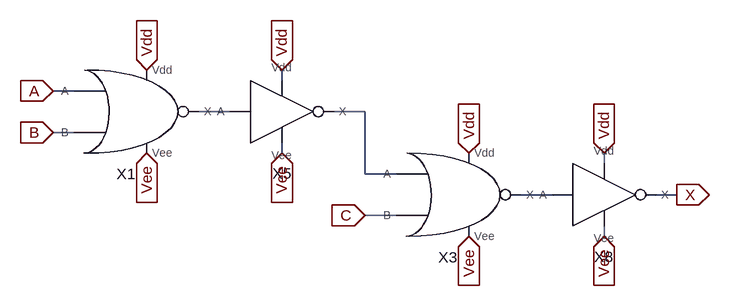
[diagram p0: schematic 3-NOR.asc]
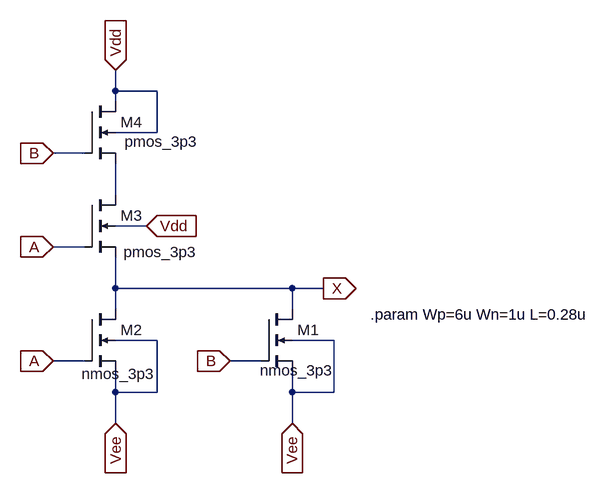
[diagram p1: sub-circuit nor2x1.asc]
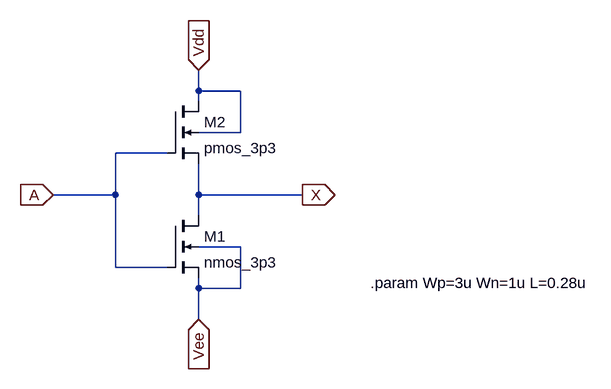
[diagram p2: sub-circuit invx1.asc]
3-NOR.asc, the LTspice schematic file:
Version 4.1
SHEET 1 880 680
WIRE 32 -32 32 -48
WIRE -288 -16 -320 -16
WIRE -48 16 -96 16
WIRE 160 16 112 16
WIRE -288 48 -320 48
WIRE 32 80 32 64
WIRE 528 96 528 80
WIRE 160 112 160 16
WIRE 208 112 160 112
WIRE 448 144 400 144
WIRE 640 144 608 144
WIRE 208 176 160 176
WIRE 528 208 528 192
FLAG -176 80 Vee
IOPIN -176 80 In
FLAG 32 -48 Vdd
IOPIN 32 -48 In
FLAG 32 80 Vee
IOPIN 32 80 In
FLAG 320 208 Vee
IOPIN 320 208 In
FLAG 528 80 Vdd
IOPIN 528 80 In
FLAG 528 208 Vee
IOPIN 528 208 In
FLAG 640 144 X
IOPIN 640 144 Out
FLAG -320 -16 A
IOPIN -320 -16 In
FLAG -320 48 B
IOPIN -320 48 In
FLAG 160 176 C
IOPIN 160 176 In
FLAG -176 -48 Vdd
IOPIN -176 -48 In
FLAG 320 80 Vdd
IOPIN 320 80 In
SYMBOL NOR2x1 -208 16 R0
SYMATTR InstName X1
SYMBOL NOR2x1 288 144 R0
SYMATTR InstName X3
SYMBOL INVx1 32 16 R0
SYMATTR InstName X5
SYMBOL INVx1 528 144 R0
SYMATTR InstName X8

nor2x1.asc, the sub-circuit schematic file:
Version 4.1
SHEET 1 2956 680
WIRE 1680 -496 1680 -528
WIRE 1744 -496 1680 -496
WIRE 1680 -480 1680 -496
WIRE 1744 -432 1744 -496
WIRE 1744 -432 1680 -432
WIRE 1632 -400 1584 -400
WIRE 1680 -336 1680 -384
WIRE 1728 -288 1680 -288
WIRE 1632 -256 1584 -256
WIRE 1680 -192 1680 -240
WIRE 1952 -192 1680 -192
WIRE 2000 -192 1952 -192
WIRE 1680 -160 1680 -192
WIRE 1952 -160 1952 -192
WIRE 1744 -112 1680 -112
WIRE 2016 -112 1952 -112
WIRE 1632 -80 1584 -80
WIRE 1904 -80 1856 -80
WIRE 1680 -32 1680 -64
WIRE 1744 -32 1744 -112
WIRE 1744 -32 1680 -32
WIRE 1952 -32 1952 -64
WIRE 2016 -32 2016 -112
WIRE 2016 -32 1952 -32
WIRE 1680 16 1680 -32
WIRE 1952 16 1952 -32
FLAG 1584 -256 A
IOPIN 1584 -256 In
FLAG 2000 -192 X
IOPIN 2000 -192 Out
FLAG 1680 -528 Vdd
IOPIN 1680 -528 In
FLAG 1584 -80 A
IOPIN 1584 -80 In
FLAG 1856 -80 B
IOPIN 1856 -80 In
FLAG 1584 -400 B
IOPIN 1584 -400 In
FLAG 1952 16 Vee
IOPIN 1952 16 In
FLAG 1680 16 Vee
IOPIN 1680 16 In
FLAG 1728 -288 Vdd
IOPIN 1728 -288 In
SYMBOL nmos4 1904 -160 R0
WINDOW 3 -2 94 Left 2
SYMATTR Value nmos_3p3
SYMATTR InstName M1
SYMATTR Value2 l={L} w={Wn}
SYMBOL nmos4 1632 -336 R0
WINDOW 3 60 88 Left 2
SYMATTR Value pmos_3p3
SYMATTR InstName M3
SYMATTR Value2 l={L} w={Wp}
SYMBOL nmos4 1632 -480 R0
WINDOW 3 62 62 Left 2
SYMATTR Value pmos_3p3
SYMATTR InstName M4
SYMATTR Value2 l={L} w={Wp}
SYMBOL nmos4 1632 -160 R0
WINDOW 3 -4 100 Left 2
SYMATTR Value nmos_3p3
SYMATTR InstName M2
SYMATTR Value2 l={L} w={Wn}
TEXT 2072 -152 Left 2 !.param Wp=6u Wn=1u L=0.28u

invx1.asc, the sub-circuit schematic file:
Version 4
SHEET 1 2776 836
WIRE 416 -16 416 -48
WIRE 480 -16 416 -16
WIRE 416 0 416 -16
WIRE 480 48 480 -16
WIRE 480 48 416 48
WIRE 368 80 288 80
WIRE 288 144 288 80
WIRE 288 144 192 144
WIRE 416 144 416 96
WIRE 576 144 416 144
WIRE 416 176 416 144
WIRE 480 224 416 224
WIRE 288 256 288 144
WIRE 368 256 288 256
WIRE 416 288 416 272
WIRE 480 288 480 224
WIRE 480 288 416 288
WIRE 416 336 416 288
FLAG 416 -48 Vdd
IOPIN 416 -48 In
FLAG 192 144 A
IOPIN 192 144 In
FLAG 576 144 X
IOPIN 576 144 Out
FLAG 416 336 Vee
IOPIN 416 336 In
SYMBOL nmos4 368 176 R0
SYMATTR InstName M1
SYMATTR Value nmos_3p3
SYMATTR Value2 l={L} w={Wn}
SYMBOL nmos4 368 0 R0
SYMATTR InstName M2
SYMATTR Value pmos_3p3
SYMATTR Value2 l={L} w={Wp}
TEXT 680 280 Left 2 !.param Wp=3u Wn=1u L=0.28u

The netlist it stands for:
* 3-NOR.asc
X§X1 A B Vdd Vee N001 nor2x1
X§X3 N002 C Vdd Vee N003 nor2x1
X§X5 N001 Vdd N002 Vee invx1
X§X8 N003 Vdd X Vee invx1

* block symbol definitions
.subckt nor2x1 A B Vdd Vee X
M1 X B Vee Vee nmos_3p3 l={L} w={Wn}
M3 N001 A X Vdd pmos_3p3 l={L} w={Wp}
M4 Vdd B N001 Vdd pmos_3p3 l={L} w={Wp}
M2 X A Vee Vee nmos_3p3 l={L} w={Wn}
.param Wp=6u Wn=1u L=0.28u
.ends nor2x1

.subckt invx1 A Vdd X Vee
M1 X A Vee Vee nmos_3p3 l={L} w={Wn}
M2 Vdd A X Vdd pmos_3p3 l={L} w={Wp}
.param Wp=3u Wn=1u L=0.28u
.ends invx1

.model NMOS NMOS
.model PMOS PMOS
.lib standard.mos
.backanno
.end